# EasyEDA schematic Bachelor_ESP32.json
TITLE: Sheet_1; REV: 1.0; Date: 2019-10-20; Sheet: 1/1; Drawn By: aptyp1998; Company: Your Company
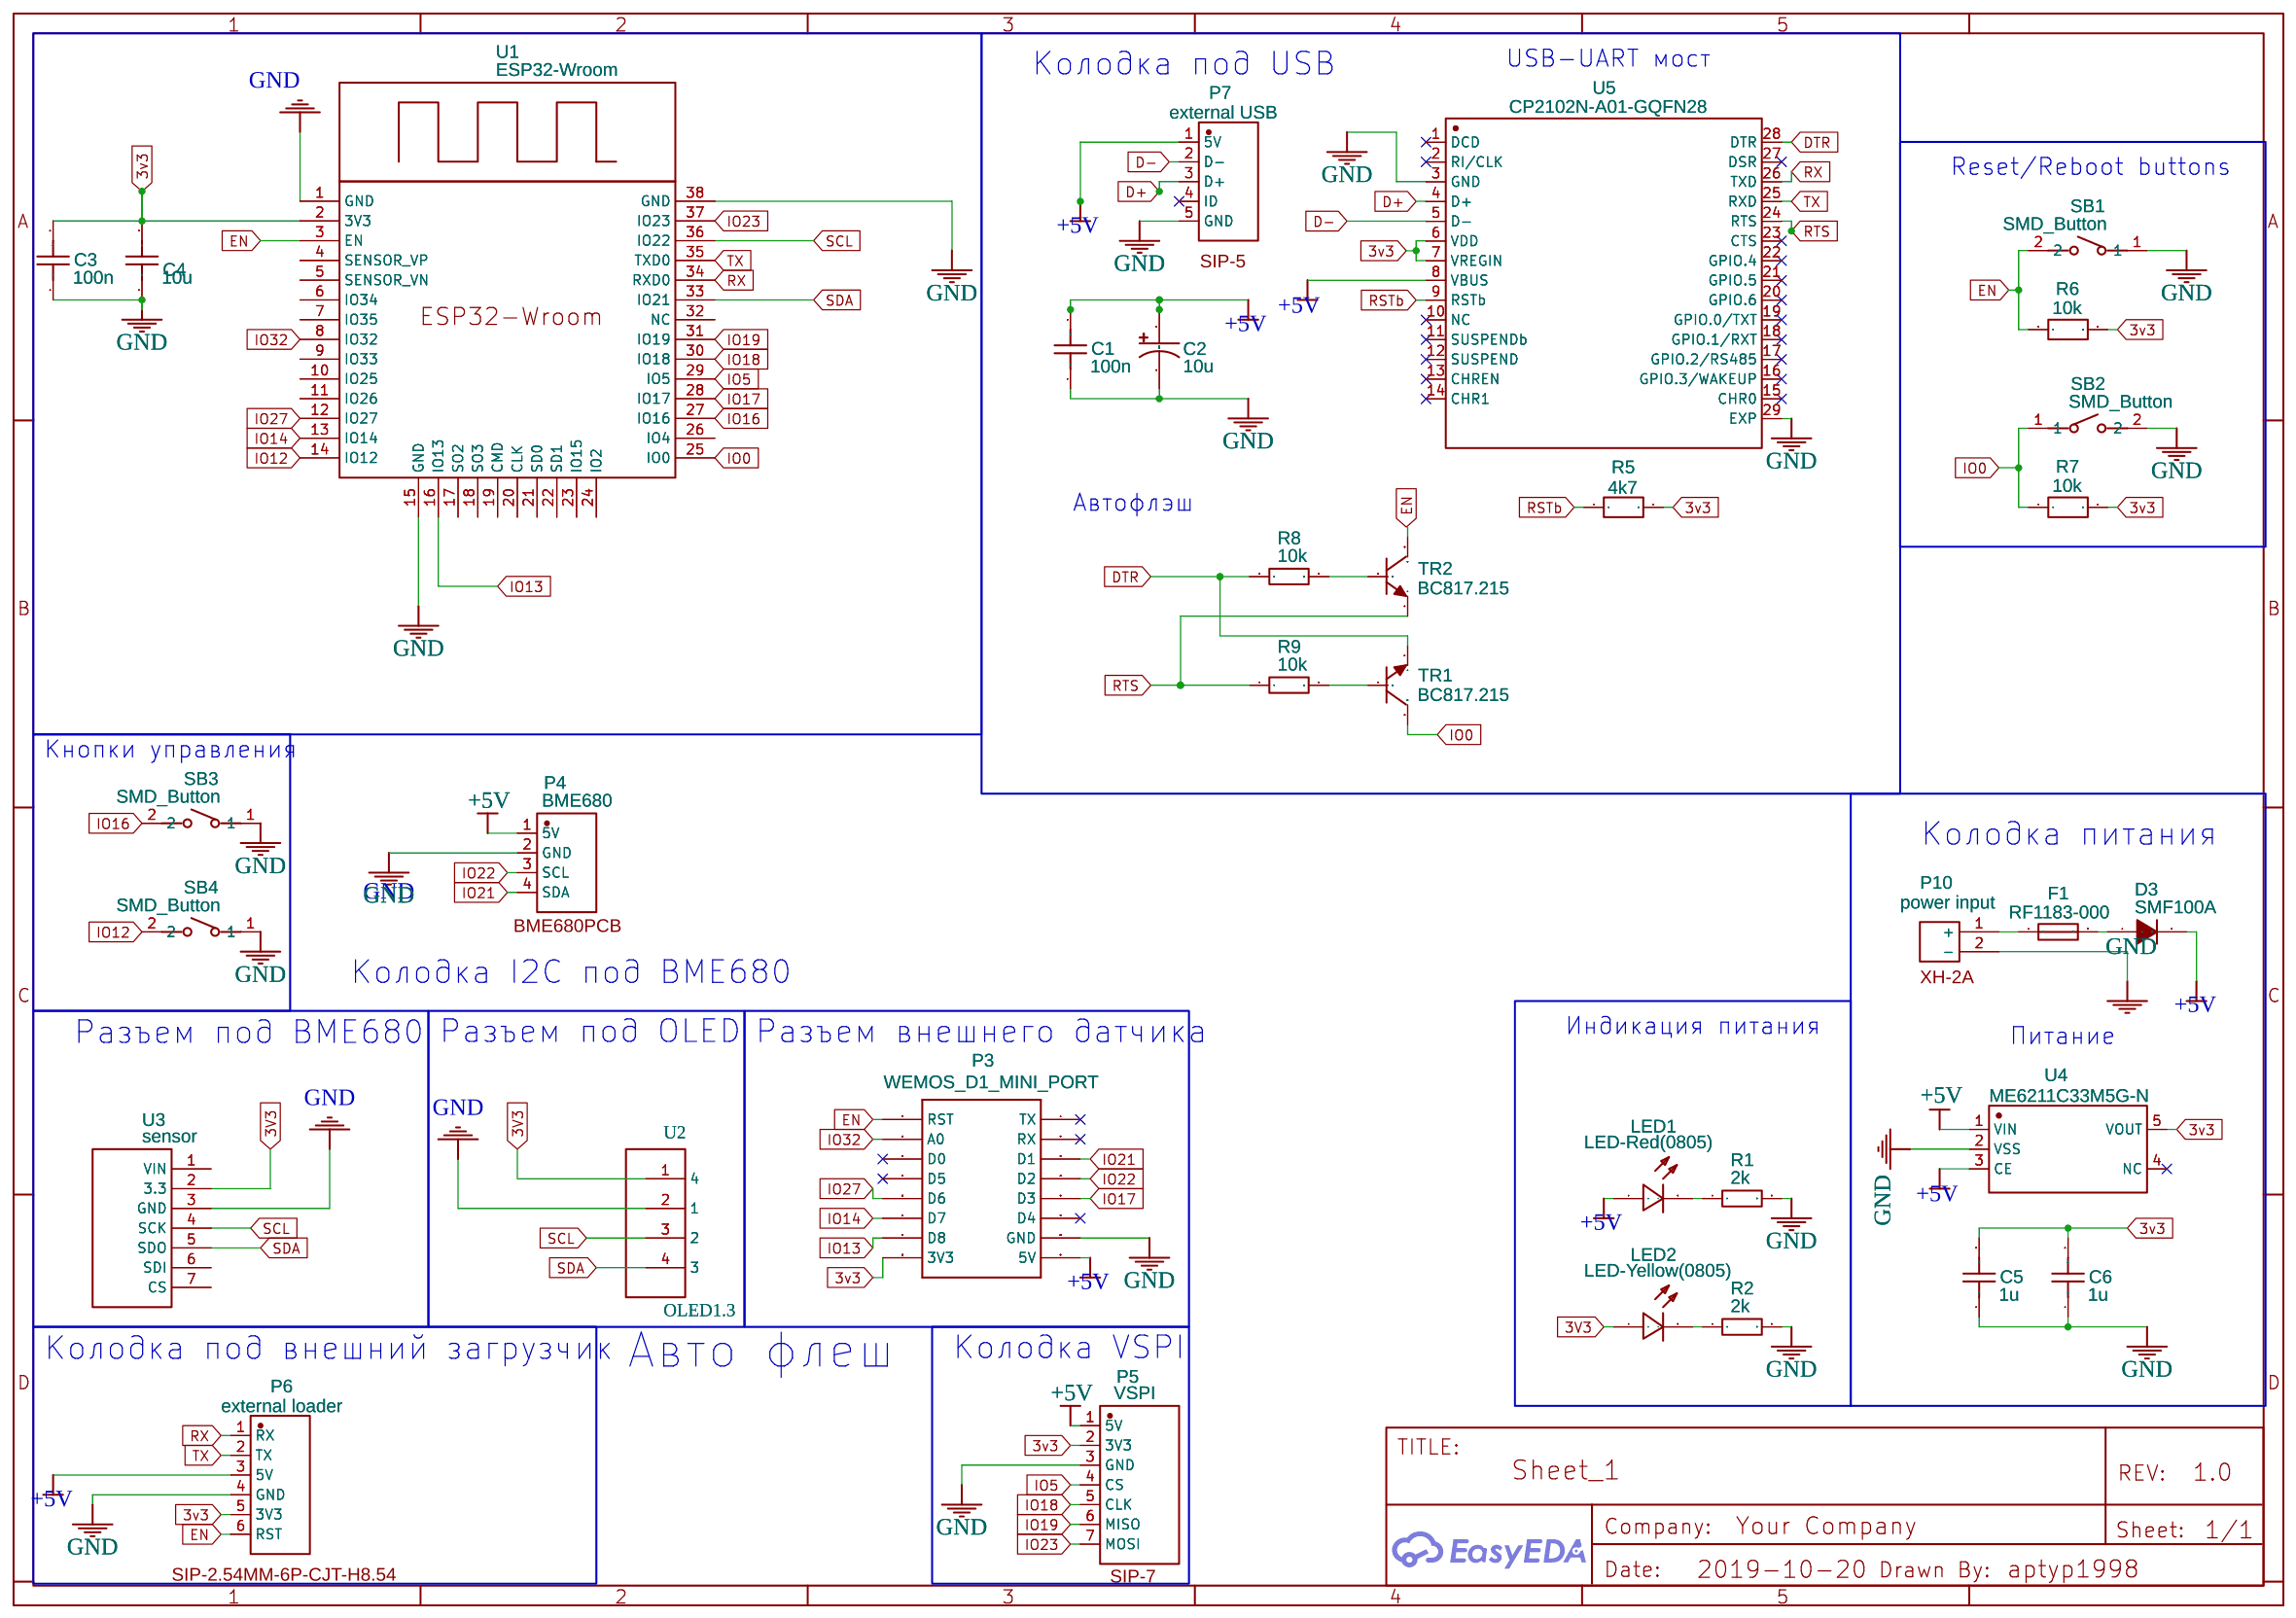
[diagram p0: schematic sheet]

## Parts
C1  100n  [0805]
C2  10u  [CAP-D4.0XF1.5]
C3  100n  [0805]
C4  10u  [0805]
C5  1u  [0805]
C6  1u  [0805]
D3  SMF100A  [SOD-123F]
F1  RF1183-000  [1812]
LED1  LED-Red(0805)  [LED-0805]
LED2  LED-Yellow(0805)  [LED-0805]
P3  WEMOS_D1_MINI_PORT  [WEMOS_D1_MINI_SIZE FOR SHIELD]
P4  BME680  [BME680PCB]
P5  VSPI  [SIP-7]
P6  external loader  [SIP-2.54MM-6P-CJT-H8.54]
P7  external USB  [SIP-5]
P10  power input  [XH-2A]
R1  2k  [0805]
R2  2k  [0805]
R5  4k7  [0805]
R6  10k  [0805]
R7  10k  [0805]
R8  10k  [0805]
R9  10k  [0805]
SB1  SMD_Button  [SMD BUTTON AAA]
SB2  SMD_Button  [SMD BUTTON AAA]
SB3  SMD_Button  [SMD BUTTON AAA]
SB4  SMD_Button  [SMD BUTTON AAA]
TR1  BC817.215  [SOT-23(SOT-23-3)]
TR2  BC817.215  [SOT-23(SOT-23-3)]
U1  ESP32-Wroom  [ESP32_WROOM_FOOTPRINT]
U2  OLED1.3  [STOOK_OLED_1.3]
U3  sensor  [BME680FOOTPRINT]
U4  ME6211C33M5G-N  [SOT-23-5]
U5  CP2102N-A01-GQFN28  [QFN-28_5X5X05P]

## Library data of the parts
C1 C3-C6 = Cap_0805_US: Manufacturer Part: ?
C2 = Cap_Electrolytic(TH)_D4.0XF1.5_US: Manufacturer Part: ?
D3 = -: Supplier: LCSC; Contributor: Andreika123; Manufacturer Part: ?; Supplier Part: undefined
F1 = -: Supplier: LCSC; Supplier Part: C207183; Manufacturer: Littelfuse; Contributor: LCSC
LED1 = -: Supplier: LCSC; Manufacturer: Hubei KENTO Elec; Manufacturer Part: KT-0603R; Supplier Part: C2286
LED2 = -: Supplier: LCSC; Manufacturer: Hubei KENTO Elec; Manufacturer Part: 17-21SUYC/TR8; Supplier Part: C2296
P3 = -: sourceId: YemgaslDx; Contributor: Andreika123; Manufacturer Part: ?
P4-P7 = -: Manufacturer Part: ?; Package Display: Yes
P10 = -: Supplier: LCSC; Manufacturer: BOOMELE; image: //image.lceda.cn/szlcsc/C20079.jpg; Supplier Part: C20079; Contributor: Andreika123; Package Display: Yes
R1 R2 R8 R9 = SMD Resistor: Supplier Part: C72672; Supplier: LCSC; Manufacturer: Shiheng; Manufacturer Part: CMFB103F3970
R5 = Res_AXIAL-0.3(1/8W)_EU: Manufacturer Part: ?
R6 R7 = Res_0805(1/8W)_EU: Manufacturer Part: ?
SB1-SB4 = -: SMD Button Top;12V; Manufacturer Part: DHT-1163S; Contributor: Andreika123
TR1 TR2 = -: Supplier Part: undefined; Supplier: LCSC; Manufacturer: ON; Manufacturer Part: BC817-16LT1G; Contributor: Andreika123
U1 = -: Contributor: cunt123
U3 = -: Manufacturer Part: bme680; Contributor: b.myers37
U4 = -: Supplier: LCSC; Manufacturer: MICRONE; image: //image.lceda.cn/szlcsc/C82942.jpg; Supplier Part: C82942; LCSC Assembly: Yes; SMT Type: Extend
U5 = -: Supplier: LCSC; Manufacturer: SILICON LABS; Contributor: LCSC; Supplier Part: C105167

## Nets
3V3: LED2.1(+) U2.1(4) U3.2(3.3)
3v3: C3.2 C4.2 C5.2 C6.2 P3.3V3 P5.2(3V3) P6.5(3V3) R5.2 R6.2 R7.2 U1.2(3V3) U4.5(VOUT) U5.6(VDD) U5.7(VREGIN)
+5V: C1.2 C2.1 D3.2(K) LED1.1(+) P3.5V P4.1(5V) P5.1(5V) P6.3(5V) P7.1(5V) U4.1(VIN) U4.3(CE)
GND: C1.1 C2.2 C3.1 C4.1 C5.1 C6.1 P3.GND P4.2(GND) P5.3(GND) P6.4(GND) P7.5(GND) P10.2(-) R1.2 R2.2 SB1.1 SB2.2 SB3.1 SB4.1 U1.1(GND) U1.15(GND) U1.38(GND) U2.2(1) U3.3(GND) U4.2(VSS) U5.3(GND) U5.29(EXP)
D+: P7.3(D+) U5.4(D+)
D-: P7.2(D-) U5.5(D-)
DTR: R8.1 TR1.2(E) U5.28(DTR)
EN: P3.RST P6.6(RST) R6.1 SB1.2 U1.3(EN)
IO0: R7.1 SB2.1 TR1.3(C) U1.25(IO0)
IO5: P5.4(CS) U1.29(IO5)
IO12: SB4.2 U1.14(IO12)
IO13: P3.D8 U1.16(IO13)
IO14: P3.D7 U1.13(IO14)
IO16: SB3.2 U1.27(IO16)
IO17: P3.D3 U1.28(IO17)
IO18: P5.5(CLK) U1.30(IO18)
IO19: P5.6(MISO) U1.31(IO19)
IO21: P3.D1 P4.4(SDA)
IO22: P3.D2 P4.3(SCL)
IO23: P5.7(MOSI) U1.37(IO23)
IO27: P3.D6 U1.12(IO27)
IO32: P3.A0 U1.8(IO32)
RSTb: R5.1 U5.9(RSTb)
RTS: R9.1 TR2.2(E) U5.24(RTS)
RX: P6.1(RX) U1.34(RXD0) U5.26(TXD)
SCL: U1.36(IO22) U2.3(2) U3.4(SCK)
SDA: U1.33(IO21) U2.4(3) U3.5(SDO)
TX: P6.2(TX) U1.35(TXD0) U5.25(RXD)
F1_2: D3.1(A) F1.2
P10_1: F1.1 P10.1(+)
R1_1: LED1.2(-) R1.1
R2_1: LED2.2(-) R2.1
TR1_1: R9.2 TR1.1(B)
TR2_1: R8.2 TR2.1(B)

Not connected (* = marked no-connect by the designer): P3 D0* D4* D5* RX* TX*; P7 4(ID)*; TR2 3(C); U1 4(SENSOR_VP) 5(SENSOR_VN) 6(IO34) 7(IO35) 9(IO33) 10(IO25) 11(IO26) 17(SO2) 18(SO3) 19(CMD) 20(CLK) 21(SD0) 22(SD1) 23(IO15) 24(IO2) 26(IO4) 32(NC); U3 1(VIN) 6(SDI) 7(CS); U4 4(NC)*; U5 1(DCD)* 2(RI/CLK)* 8(VBUS) 10(NC)* 11(SUSPENDb)* 12(SUSPEND)* 13(CHREN)* 14(CHR1)* 15(CHR0)* 16(GPIO.3/WAKEUP)* 17(GPIO.2/RS485)* 18(GPIO.1/RXT)* 19(GPIO.0/TXT)* 20(GPIO.6)* 21(GPIO.5)* 22(GPIO.4)* 23(CTS)* 27(DSR)*

## Notes on the sheet
- Колодка под USB
- USB-UART мост
- Reset/Reboot buttons
- Автофлэш
- Кнопки управления
- Колодка питания
- GND
- Колодка I2C под BME680
- Разъем под BME680
- Разъем под OLED
- Разъем внешнего датчика
- Индикация питания
- Питание
- Колодка под внешний загрузчик
- Авто флеш
- Колодка VSPI
